# EAGLE board MMC_2 (EAGLE 9.6.2)
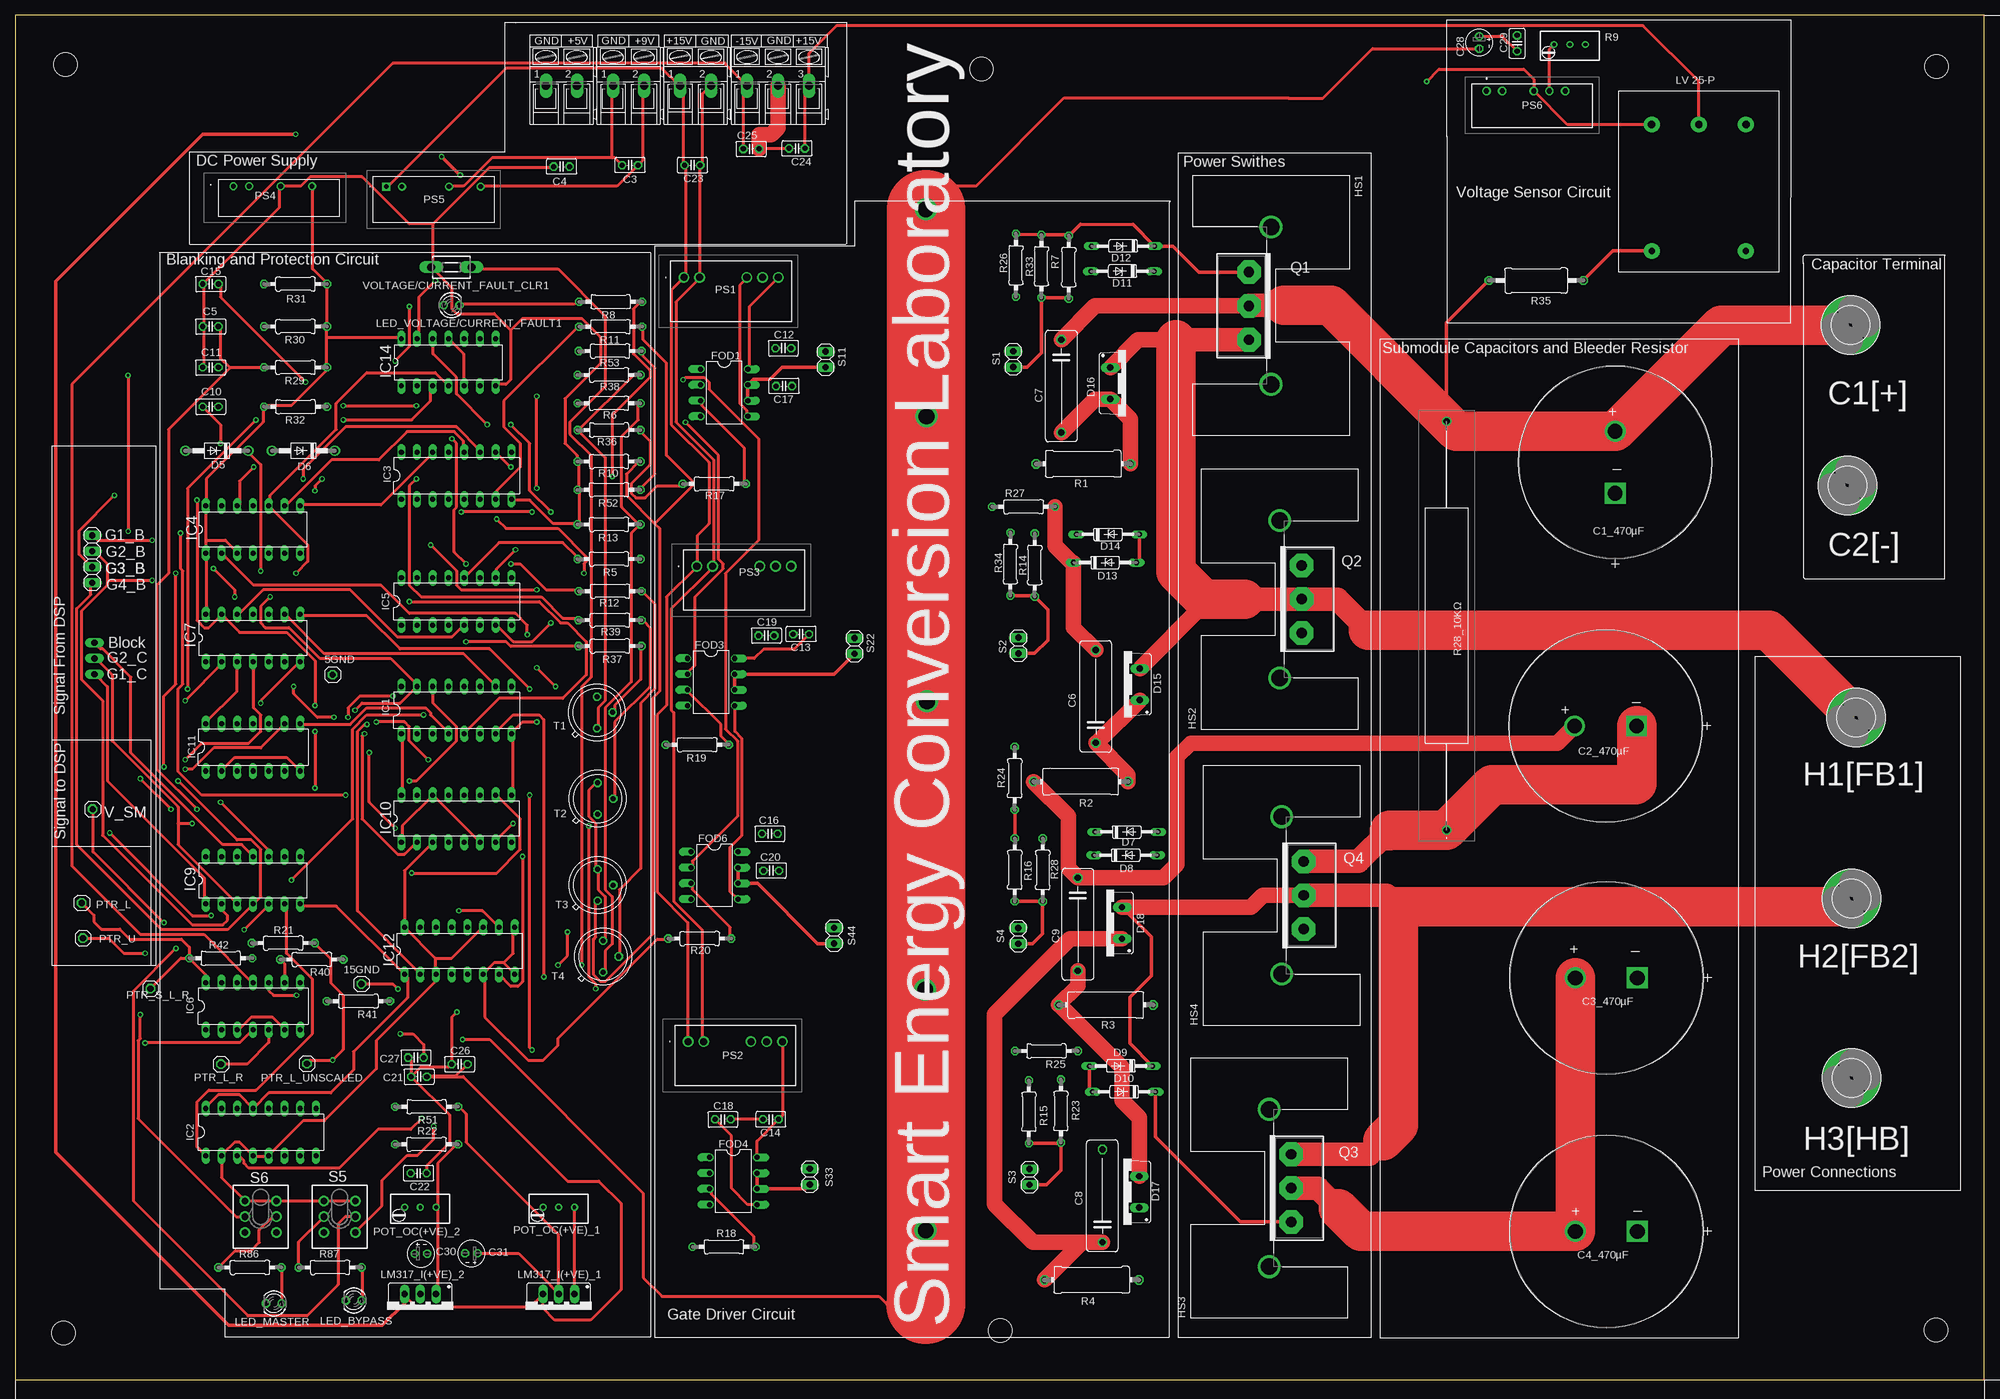
[diagram p2: board, top side]
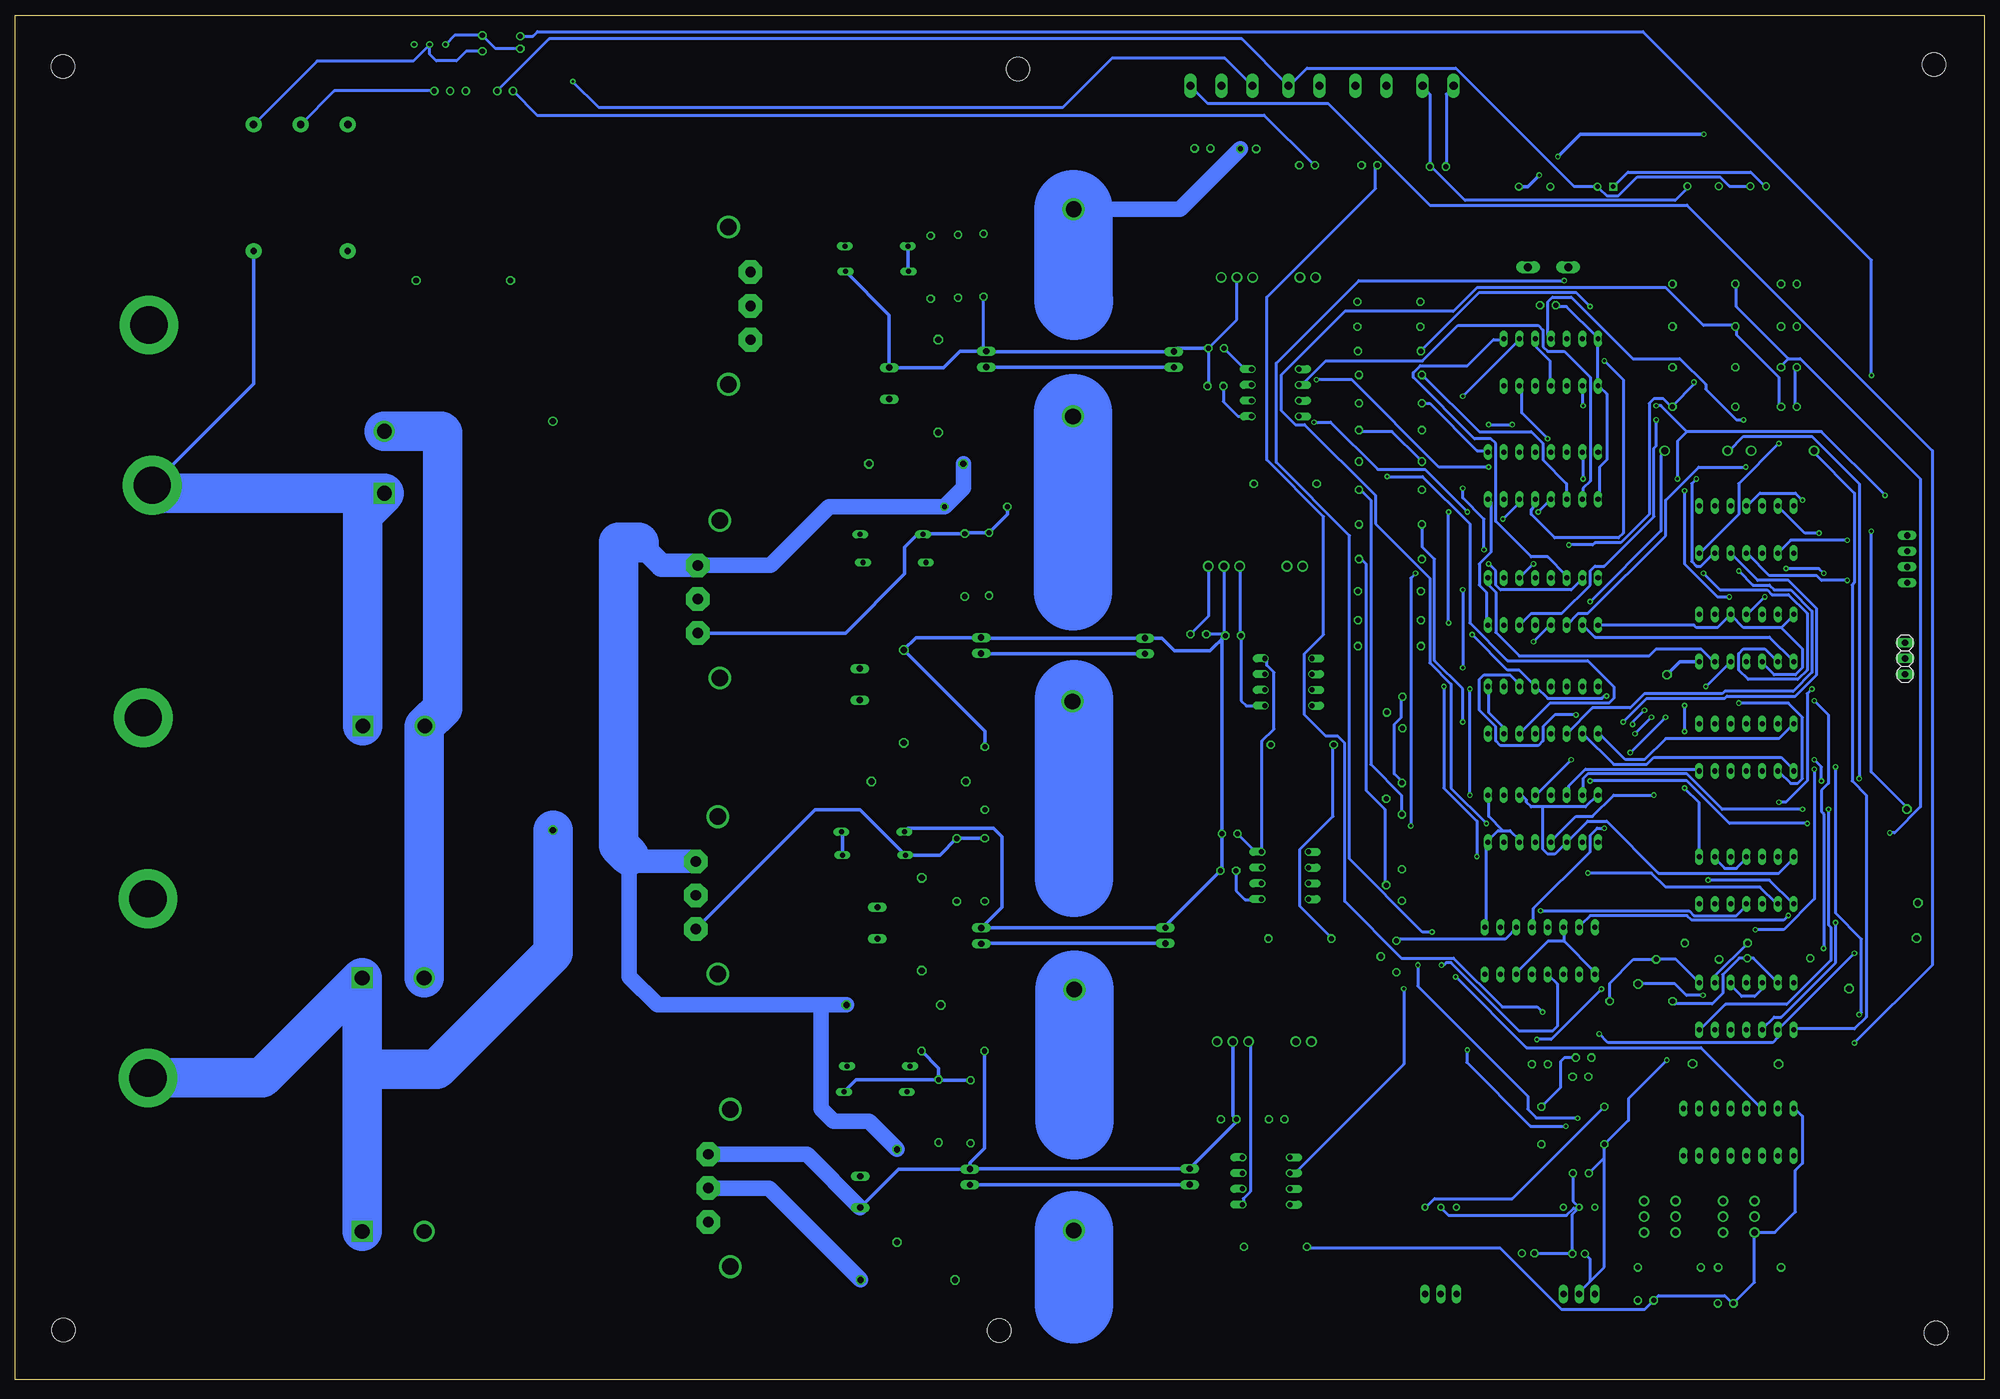
[diagram p3: board, bottom side, seen from below]

Size 317.85 x 220.25 mm. Coordinates in mm from the lower left corner, seen from the top.
Outline: 0,0 317.85,0 317.85,220.25 0,220.25 0,0
Copper layers (1*16): Top 0.035mm / dielectric 1.5mm / Bottom 0.035mm
Design rules "default": minimum track width 6mil, minimum drill 0.35mm, track to track 6mil, track to pad 6mil, pad to pad 6mil, via to via 6mil, smd to smd 6mil, copper to edge 40mil, drill to drill 6mil, minimum pad ring 10mil, minimum via ring 8mil, stop-mask expansion 4mil, vias tented up to drill 0mil, thermal gap 10mil
Net classes: 0 default: width 0.457 mm, drill 0.457 mm, clearance 0.305 mm
Holes 3.81 mm at 310.11,8.05 310.15,212.03 155.98,211.6 159.02,7.98 7.77,7.54 8.08,212.36

## Footprints (pad centres in the part's own frame; a part is rotated, then mirrored left to right if it is on the bottom)
1X01 = drill 1.016 octagon: 1 0,0
6-PAD = drill 6 pad 9.5: B5,5 0,0
CAP_2157_30X50_VIS = drill 2.362 pad 2.87 square: 1 0,0 | drill 2.362 pad 2.87: 2 10.008,0
C025-025X050 = drill 0.813 octagon: 1 -1.27,0; 2 1.27,0
C150-054X183 = drill 1.016 octagon: 1 -7.493,0; 2 7.493,0
E2-4 = drill 0.813 pad 1.27: + -1.016,0 | drill 0.813 pad 1.27 octagon: - 1.016,0
DO41-10 = drill 1.118: A 5.08,0; C -5.08,0
DO35Z10 = drill 0.813 long: A 5.08,0; C -5.08,0
TO220ACS = drill 1.016 long: A 2.54,-2.54; C -2.54,-2.54
DIL08 = drill 0.813 offset: 1 -3.81,-3.81; 2 -1.27,-3.81; 3 1.27,-3.81; 4 3.81,-3.81; 5 3.81,3.81; 6 1.27,3.81; 7 -1.27,3.81; 8 -3.81,3.81
1X03 = drill 1.016 long: 1 -2.54,0; 2 0,0; 3 2.54,0
1X04 = drill 1.016 long: 1 -3.81,0; 2 -1.27,0; 3 1.27,0; 4 3.81,0
HSINK_6396BG = drill 2.67: 1 -12.7,0; 2 12.7,0
DIL16 = drill 0.813 long: 1 -8.89,-3.81; 2 -6.35,-3.81; 3 -3.81,-3.81; 4 -1.27,-3.81; 5 1.27,-3.81; 6 3.81,-3.81; 7 6.35,-3.81; 8 8.89,-3.81; 9 8.89,3.81; 10 6.35,3.81; 11 3.81,3.81; 12 1.27,3.81; 13 -1.27,3.81; 14 -3.81,3.81; 15 -6.35,3.81; 16 -8.89,3.81
DIL14 = drill 0.8 long: 1 -7.62,-3.81; 2 -5.08,-3.81; 3 -2.54,-3.81; 4 0,-3.81; 5 2.54,-3.81; 6 5.08,-3.81; 7 7.62,-3.81; 8 7.62,3.81; 9 5.08,3.81; 10 2.54,3.81; 11 0,3.81; 12 -2.54,3.81; 13 -5.08,3.81; 14 -7.62,3.81
DIL14' = drill 0.813 long: 1 -7.62,-3.81; 2 -5.08,-3.81; 3 -2.54,-3.81; 4 0,-3.81; 5 2.54,-3.81; 6 5.08,-3.81; 7 7.62,-3.81; 8 7.62,3.81; 9 5.08,3.81; 10 2.54,3.81; 11 0,3.81; 12 -2.54,3.81; 13 -5.08,3.81; 14 -7.62,3.81
LV25-P = drill 1 pad 2.54: 1 -7.54,9.15; 2 7.66,9.15 | drill 1.2 pad 2.54: 3 -7.54,-11.25; 4 0.06,-11.25; 5 7.66,-11.25
LED3MM = drill 0.813 octagon: A -1.27,0; K 1.27,0
317TS = drill 1.016 long: 1 -2.54,-2.54; 2 0,-2.54; 3 2.54,-2.54
RTRIMT93YA = drill 0.61: 1 0,-2.54; 2 0,0; 3 0,2.54
MGJ2D151505SC = drill 1.15 pad 1.725: 1 0,0; 2 2.54,0; 5 10.16,0; 6 12.7,0; 7 15.24,0
TMA0505S = drill 0.76 pad 1.26: 1 0,0; 2 2.54,0; 4 7.62,0; 6 12.7,0
TMV1512SHI = drill 0.76 pad 1.303 square: 1 0,0 | drill 0.76 pad 1.303: 2 2.54,0; 5 10.16,0; 7 15.24,0
TMA0515D = drill 0.83 pad 1.33: 1 0,0; 2 2.54,0; 3 7.62,0; 4 10.16,0; 5 12.7,0
TO247-V = drill 1.676 pad 3.81 octagon: 1 -5.461,0; 2 0,0; 3 5.461,0
0414/15 = drill 1.016 octagon: 1 -7.62,0; 2 7.62,0
0207/10 = drill 0.813 octagon: 1 -5.08,0; 2 5.08,0
SBCHE610KJ = drill 1 pad 1.5: 1 0,0; 2 66,0
0411/15 = drill 0.914 octagon: 1 -7.62,0; 2 7.62,0
1X02 = drill 1.016 long: 1 -1.27,0; 2 1.27,0
TL4XPO = drill 1.1 pad 1.676: 1 -2.54,2.54; 2 0,2.54; 3 2.54,2.54; 4 -2.54,-2.54; 5 0,-2.54; 6 2.54,-2.54
TO39 = drill 0.813 octagon: 1 0,-2.54; 2 2.54,0; 3 0,2.54
DTS-3 = drill 1.3 long: 1 -3.25,0; 2 3.25,0
AK300/2 = drill 1.321 long: 1 -2.515,0; 2 2.489,0
AK300/3 = drill 1.321 long: 1 -5.004,0; 2 0,0; 3 5.004,0

## Placement (x,y rotation side)
5GND  [1X01]  51.2,113.82 0 top
15GND  [1X01]  55.86,63.93 0 top
C1  [6-PAD]  296.3,170.28 0 top
C1_470µF  MAL215746471E3  [CAP_2157_30X50_VIS]  258.3,143.12 90 top
C2  [6-PAD]  295.79,144.39 180 top
C2_470µF  MAL215746471E3  [CAP_2157_30X50_VIS]  261.75,105.56 180 top
C3  0.1uF  [C025-025X050]  99.23,196.09 180 top
C3_470µF  MAL215746471E3  [CAP_2157_30X50_VIS]  261.88,64.89 180 top
C4  0.1uF  [C025-025X050]  88.18,195.87 180 top
C4_470µF  MAL215746471E3  [CAP_2157_30X50_VIS]  261.88,23.97 180 top
C5  470pF  [C025-025X050]  31.5,170.05 0 top
C6  10nF  [C150-054X183]  174.43,110.33 90 top
C7  10nF  [C150-054X183]  168.87,160.42 270 top
C8  10nF  [C150-054X183]  175.51,29.71 90 top
C9  10nF  [C150-054X183]  171.53,73.55 270 top
C10  470pF  [C025-025X050]  31.5,157.09 0 top
C11  470pF  [C025-025X050]  31.5,163.44 0 top
C12  0.1uF  [C025-025X050]  123.98,166.54 0 top
C13  0.1uF  [C025-025X050]  126.85,120.39 180 top
C14  0.1uF  [C025-025X050]  121.95,42.06 180 top
C15  470pF  [C025-025X050]  31.5,176.9 0 top
C16  0.1uF  [C025-025X050]  121.8,88.16 0 top
C17  0.1uF  [C025-025X050]  124.1,160.43 180 top
C18  0.1uF  [C025-025X050]  114.21,42.06 0 top
C19  0.1uF  [C025-025X050]  121.24,120.16 0 top
C20  0.1uF  [C025-025X050]  122.03,82.21 0 top
C21  0.1uF  [C025-025X050]  65.16,48.95 0 top
C22  1uF  [C025-025X050]  65.09,33.36 180 top
C23  0.1uF  [C025-025X050]  109.3,196.08 180 top
C24  0.1uF  [C025-025X050]  126.18,198.79 180 top
C25  0.1uF  [C025-025X050]  118.79,198.71 0 top
C26  0.1uF  [C025-025X050]  71.71,50.97 0 top
C27  1uF  [C025-025X050]  64.65,52.04 0 top
C28  [E2-4]  236.34,215.91 270 top
C29  1uF  [C025-025X050]  242.46,215.75 90 top
C30  [E2-4]  65.48,20.38 0 top
C31  [E2-4]  73.6,20.43 180 top
D5  1N4004  [DO41-10]  32.52,149.98 180 top
D6  1N4004  [DO41-10]  46.49,149.98 180 top
D7  [DO35Z10]  179.41,88.46 0 top
D8  [DO35Z10]  179.25,84.7 0 top
D9  [DO35Z10]  178.49,50.67 180 top
D10  [DO35Z10]  179,46.5 180 top
D11  [DO35Z10]  178.75,178.96 180 top
D12  [DO35Z10]  178.85,183.03 180 top
D13  [DO35Z10]  175.93,131.95 0 top
D14  [DO35Z10]  176.38,136.49 0 top
D15  BYW80  [TO220ACS]  179,112.29 90 top
D16  BYW80  [TO220ACS]  179.31,160.88 270 top
D17  BYW80  [TO220ACS]  178.92,30.35 90 top
D18  BYW80  [TO220ACS]  176.13,73.76 90 top
FOD1  FOD3182  [DIL08]  114.43,159.35 270 top
FOD3  FOD3182  [DIL08]  112.3,112.64 270 top
FOD4  FOD3182  [DIL08]  115.91,32.1 270 top
FOD6  FOD3182  [DIL08]  112.86,81.43 270 top
GATE_SIGNAL_FROM_DSP  [1X03]  12.76,116.45 90 bottom
GATE_SIGNALS_BLANKING  [1X04]  12.4,132.51 270 top
H1  [6-PAD]  297.21,106.9 0 top
H2  [6-PAD]  296.45,77.69 0 top
H3  [6-PAD]  296.45,48.74 0 top
HS1  6396BG  [HSINK_6396BG]  202.74,173.41 270 top
HS2  6396BG  [HSINK_6396BG]  204.13,126.02 90 top
HS3  6396BG  [HSINK_6396BG]  202.43,30.97 90 top
HS4  6396BG  [HSINK_6396BG]  204.44,78.21 90 top
IC1  4050N  [DIL16]  71.2,108.12 0 top
IC2  7476N  [DIL16]  39.63,40 0 top
IC3  4050N  [DIL16]  71.2,145.97 0 top
IC4  74AC11N  [DIL14]  38.36,137.28 0 top
IC5  4050N  [DIL16]  71.2,125.65 0 top
IC6  TL064P  [DIL14']  38.36,60.32 0 top
IC7  74AC11N  [DIL14]  38.36,119.75 0 top
IC8  LV25-P  [LV25-P]  271.86,191.38 180 top
IC9  74ALS04N  [DIL14]  38.36,80.64 0 top
IC10  74LS123N  [DIL16]  71.2,90.6 0 top
IC11  4075N  [DIL14']  38.36,102.1 0 top
IC12  74LS123N  [DIL16]  71.71,69.26 0 top
IC14  74AC11N  [DIL14]  69.93,164.26 0 top
LED_BYPASS  [LED3MM]  54.62,12.82 180 top
LED_MASTER  [LED3MM]  41.71,12.34 180 top
LED_VOLTAGE/CURRENT_FAULT1  [LED3MM]  70.42,173.48 0 top
LM317_I(+VE)_1  [317TS]  87.71,11.35 180 top
LM317_I(+VE)_2  [317TS]  65.36,11.35 180 top
POT_OC(+VE)_1  [RTRIMT93YA]  87.71,27.86 90 top
POT_OC(+VE)_2  [RTRIMT93YA]  65.36,27.86 90 top
PS1  MGJ2D151505SC  [MGJ2D151505SC]  107.93,177.97 0 top
PS2  MGJ2D151505SC  [MGJ2D151505SC]  108.59,54.6 0 top
PS3  MGJ2D151505SC  [MGJ2D151505SC]  110.01,131.34 0 top
PS4  TMA_1505S  [TMA0505S]  35.19,192.68 0 top
PS5  TMV_1509SHI  [TMV1512SHI]  59.87,192.63 0 top
PS6  TMA_0515D  [TMA0515D]  237.52,208.07 0 top
PTR_L  [1X01]  10.69,76.99 0 top
PTR_L_R  [1X01]  33.18,50.96 0 top
PTR_L_UNSCALED  [1X01]  47.06,51.04 0 top
PTR_S_L_R  [1X01]  21.77,63.15 0 top
PTR_U  [1X01]  10.89,71.3 0 top
Q1  TIP35-V  [TO247-V]  199.17,173.37 270 top
Q2  TIP35-V  [TO247-V]  207.7,126.03 90 top
Q3  TIP35-V  [TO247-V]  206,30.96 90 top
Q4  TIP35-V  [TO247-V]  208.01,78.23 90 top
R1  2kΩ  [0414/15]  172.42,147.87 180 top
R2  2kΩ  [0414/15]  172.02,96.59 0 top
R3  2kΩ  [0414/15]  176.05,60.52 0 top
R4  2kΩ  [0414/15]  173.77,16.15 180 top
R5  220Ω  [0207/10]  95.84,132.51 0 top
R6  47Ω  [0207/10]  95.84,157.65 0 top
R7  18Ω  [0207/10]  170.07,179.62 270 top
R8  680Ω  [0207/10]  96.1,174.03 180 top
R9  300 R  [RTRIMT93YA]  250.96,215.56 90 top
R10  1.2kΩ  [0207/10]  95.84,148.25 0 top
R11  47Ω  [0207/10]  96.1,170.02 0 top
R12  220Ω  [0207/10]  96.02,127.32 0 top
R13  1.2kΩ  [0207/10]  95.84,138.09 0 top
R14  18Ω  [0207/10]  164.57,131.54 270 top
R15  18Ω  [0207/10]  163.62,43.28 90 top
R16  18Ω  [0207/10]  161.35,82.34 90 top
R17  220Ω  [0207/10]  112.83,144.65 0 top
R18  220Ω  [0207/10]  114.41,21.48 0 top
R19  220Ω  [0207/10]  110.09,102.53 0 top
R20  220Ω  [0207/10]  110.47,71.24 0 top
R21  10kΩ  [0207/10]  43.25,70.52 0 top
R22  120Ω  [0207/10]  66.38,38.02 0 top
R23  18Ω  [0207/10]  168.79,43.4 90 top
R24  1kΩ  [0207/10]  161.34,97.11 90 top
R25  1kΩ  [0207/10]  166.47,53.09 180 top
R26  1kΩ  [0207/10]  161.54,179.94 270 top
R27  1kΩ  [0207/10]  162.78,140.95 0 top
R28  18Ω  [0207/10]  165.87,82.32 90 top
R28_10KΩ  SBCHE610KJ  [SBCHE610KJ]  231.07,88.74 90 top
R29  12kΩ  [0207/10]  45.22,163.44 0 top
R30  12kΩ  [0207/10]  45.22,170.05 0 top
R31  12kΩ  [0207/10]  45.22,176.9 0 top
R32  12kΩ  [0207/10]  45.22,157.09 180 top
R33  18Ω  [0207/10]  165.65,179.78 270 top
R34  18Ω  [0207/10]  160.64,131.69 270 top
R35  75kΩ  [0411/15]  245.54,177.48 0 top
R36  1.2kΩ  [0207/10]  95.84,153.33 180 top
R37  220Ω  [0207/10]  95.99,118.46 0 top
R38  47Ω  [0207/10]  95.84,162.22 0 top
R39  220Ω  [0207/10]  95.99,122.65 0 top
R40  2kΩ  [0207/10]  47.86,67.88 0 top
R41  10kΩ  [0207/10]  55.37,61.14 180 top
R42  10kΩ  [0207/10]  33.14,68.07 180 top
R51  120Ω  [0207/10]  66.38,44.11 180 top
R52  1.2kΩ  [0207/10]  95.84,143.68 0 top
R53  47Ω  [0207/10]  96.02,166.08 0 top
R86  680Ω  [0207/10]  37.85,18.15 0 top
R87  680Ω  [0207/10]  50.81,18.15 0 top
S1  [1X02]  161.11,164.76 90 top
S2  [1X02]  161.94,118.55 90 top
S3  [1X02]  163.74,32.77 90 top
S4  [1X02]  161.91,71.69 90 top
S5  TL42PO  [TL4XPO]  52.34,26.35 270 top
S6  TL42PO  [TL4XPO]  39.59,26.35 270 top
S11  [1X02]  130.8,164.73 90 top
S22  [1X02]  135.48,118.48 90 top
S33  [1X02]  128.26,32.8 90 top
S44  [1X02]  132.18,71.72 90 top
T1  2N1711  [TO39]  93.89,107.74 0 top
T2  2N1711  [TO39]  93.99,93.82 0 top
T3  2N1711  [TO39]  93.99,79.88 0 top
T4  2N1711  [TO39]  94.88,68.35 0 top
V_SM  [1X01]  12.47,92.13 0 top
VOLTAGE/CURRENT_FAULT_CLR1  DTS-3  [DTS-3]  70.39,179.62 180 top
X1  [AK300/2]  88.16,208.9 0 top
X2  [AK300/2]  99,208.9 0 top
X3  [AK300/2]  109.81,208.91 0 top
X4  [AK300/3]  123.13,208.9 0 top

## Tracks (layer width: path | path; a pad name or v marks a point on that pad's centre or on a via)
5GND  (via drill 0.46)
  Top 0.457: v33.12,151.16 33.12,154.21 C10.1 | C11.1 30.45,163.74 30.45,169.83 C5.1 30.45,170.21 30.45,176.69 C15.1 30.45,177.07 42.64,189.26 42.64,192.31 PS4.4 43.02,192.69 46.07,192.69 47.59,194.22 55.98,194.22 63.6,186.59 67.41,186.59 | R17.1 107.41,144.3 103.6,144.3 101.7,142.4 100.17,142.4 99.41,143.16 99.41,144.69 102.46,147.73 102.46,151.54 100.93,153.07 R36.1 | IC3.8 80.36,142.02 83.03,142.02 86.84,138.21 90.65,138.21 R13.1 91.03,138.21 91.03,143.54 R52.1 91.03,143.92 91.03,148.11 R10.1 90.65,148.5 90.65,149.26 88.74,151.16 88.74,158.4 94.46,164.12 94.46,168.31 91.41,171.35 81.88,171.35 79.98,169.45 | 79.98,169.45 79.98,161.45 79.22,160.69 77.69,160.69 IC14.7 | 79.98,169.45 77.31,172.12 71.22,172.12 70.45,172.88 70.45,176.31 67.41,179.36 VOLTAGE/CURRENT_FAULT_CLR1.2 67.41,179.74 67.41,186.59 | 67.41,186.59 76.55,195.74 86.84,195.74 C4.2 | IC2.16 30.83,44.1 32.73,46.01 36.16,46.01 IC2.13 40.9,46.35 50.91,46.35 54.59,50.03 54.59,52.98 63.32,61.7 63.32,64.95 IC12.1 51.78,76.49 46.07,76.49 IC9.7 | v39.59,109.25 39.59,109.63 45.69,115.73 IC7.7 | IC11.7 43.78,100.49 35.4,100.49 33.5,98.58 IC11.2 | 67.41,94.39 62.45,89.44 62.45,87.15 IC10.1 | IC10.9 80.36,94.77 80.36,104.3 IC1.8 80.36,104.68 81.88,106.2 v84.17,106.2 | IC10.6 67.41,94.39 | 67.41,94.39 IC10.14 | 78.84,67.34 77.31,67.34 75.79,65.82 IC12.6 75.79,65.44 75.79,58.58 82.77,51.59 85.19,51.59 87.6,54.01 87.6,55.15 103.6,71.15 105.12,71.15 R20.1 | 78.84,67.34 80.36,65.82 IC12.8 | 78.84,67.34 80.36,68.87 80.36,73.06 IC12.9
  Bottom 0.457: v33.12,151.16 39.59,144.69 39.59,139.73 45.69,133.64 IC4.7 | C11.1 30.45,163.35 30.45,157.26 C10.1 | IC5.8 80.36,122.21 80.36,127.16 81.5,128.3 81.5,131.73 79.6,133.64 79.6,141.64 79.98,142.02 IC3.8 | R36.1 100.55,153.07 95.6,153.07 91.03,148.5 R10.1 | C4.2 86.84,196.12 86.84,207.55 85.69,208.69 X1.1 | IC2.16 30.45,43.72 29.31,42.58 29.31,34.96 30.45,33.81 30.45,27.11 33.75,23.81 S6.6 37.05,15.73 LED_MASTER.K 40.74,12.48 41.88,13.62 52.55,13.62 LED_BYPASS.K 54.83,11.34 68.17,11.34 78.07,21.24 109.32,21.24 R18.1 | v39.59,109.25 31.59,109.25 29.31,106.97 29.31,97.06 30.07,96.3 31.21,96.3 33.12,98.2 IC11.2 | 77.69,88.68 78.45,88.68 79.98,87.15 IC10.8 80.36,86.77 80.36,73.44 IC12.9 | 77.69,88.68 76.55,88.68 75.03,87.15 IC10.6 | 77.69,88.68 79.98,90.96 79.98,94.39 IC10.9 | IC11.7 46.07,98.58 64.36,98.58 67.03,95.92 67.03,94.77 IC10.14 | R19.1 105.12,102.39 105.12,90.96 110.46,85.63 110.46,76.49 105.51,71.53 R20.1 | 67.79,70.77 67.79,73.06 IC12.14 | 67.79,70.77 62.83,65.82 IC12.1 | 67.79,70.77 70.45,70.77 75.41,65.82 IC12.6 | v84.17,106.2 84.17,111.54 88.74,116.11 88.74,132.49 90.65,134.4 90.65,137.83 R13.1
  Bottom 0.559: IC7.7 49.08,115.94 5GND.1
9GND  (via drill 0.46)
  Top 0.457: 96.36,197.26 96.74,197.26 97.89,196.12 C3.2 | 96.36,197.26 76.93,197.26 72.36,192.69 70.07,192.69 PS5.5 | 96.36,197.26 96.36,208.69 X2.1 | C27.1 63.89,51.53 C21.1 | C21.1 70.07,42.77 70.07,38.26 66.36,34.55 C22.1 | C21.1 65.49,50.55 70.02,50.55 C26.1 | C26.1 70.58,51.11 | v71.27,59.37 70.44,58.54 C26.1
  Bottom 0.457: POT_OC(+VE)_2.2 65.5,27.72 66.26,27.72 67.41,26.57 86.46,26.57 87.6,27.72 POT_OC(+VE)_1.2 | 65.12,28.1 POT_OC(+VE)_2.2 | C3.2 98.27,195.74 98.27,192.31 115.79,174.78 115.79,148.5 106.65,139.35 106.65,120.3 109.7,117.25 109.7,107.35 106.27,103.92 104.36,103.92 103.22,102.78 103.22,77.25 94.08,68.1 85.64,68.1 77.77,60.23 72.13,60.23 v71.27,59.37 | C22.1 66.36,28.86 POT_OC(+VE)_2.2 | POT_OC(+VE)_2.2 66.49,26.73 C30.- 72.54,20.38 C31.-
15GND  (via drill 0.46, 2.54)
  Top 0.457: C25.2 120.14,198.79 C24.2 | IC6.10 40.9,62.85 41.66,62.08 v45.39,62.08 | 15GND.1 60.93,63.93 v61.77,63.09 | v72.19,54.96 76.53,54.96 101.37,30.12 101.37,16.53 104.39,13.5 139.41,13.5 141.64,11.27 | PS6.4 247.68,214.83 R9.3 | v146.98,188.96 150.77,192.74 155.14,192.74 169.34,206.94 205.53,206.94 205.56,206.91 211.15,206.91 219.12,214.89 C28.- | 141.64,11.27 142.13,10.79 | 146.98,12.24 142.61,12.24 141.64,11.27
  Top 12.7: 146.91,12.17 146.98,12.24 v146.98,188.96
  Top 2.54: X4.2 123.13,202.14 122.03,201.03 120.02,201.03 120.02,198.75 C25.2
  Bottom 0.457: IC6.12 35.82,63.13 37.03,61.92 39.12,61.92 40.9,63.7 IC6.10 | v45.39,62.08 48.06,62.08 49.91,63.93 15GND.1 | v61.77,63.09 69.89,54.96 v72.19,54.96 | R9.3 246.96,217.02 C29.2 240.33,214.89 C28.-
  Bottom 12.7: v146.98,188.96 146.98,174.31 146.91,174.24
  Bottom 2.54: C25.2 129.81,188.96 v146.98,188.96
+5V
  Top 0.457: T4.3 95.22,71.15 95.22,78.01 94.08,79.15 94.08,82.2 T3.3 93.69,82.58 93.69,89.82 92.55,90.96 92.55,95.16 93.69,96.3 T2.3 | IC10.16 62.45,94.77 62.45,104.3 IC1.1 | 67.79,68.1 67.79,65.82 IC12.3 67.79,65.44 67.79,64.29 58.26,54.77 58.26,50.2 49.88,41.81 46.45,41.81 41.12,36.48 IC2.5 40.74,36.1 38.45,36.1 IC2.4 36.16,38.39 35.4,38.39 33.5,36.48 IC2.2 33.28,32.66 S6.4 S6.1 S5.4 S5.1 | 67.79,68.1 IC12.16 62.83,73.44 62.83,82.2 67.41,86.77 IC10.3 | 67.79,68.1 70.45,68.1 75.41,73.06 IC12.11 | IC7.3 35.78,115.73 35.78,111.16 30.83,106.2 IC11.14 | IC7.14 30.83,123.73 30.83,133.25 IC4.1 30.83,133.64 30.83,135.54 | 30.83,135.54 30.83,140.88 IC4.14 30.83,141.26 30.83,145.45 39.97,154.59 39.97,156.88 R32.2 40.35,157.26 44.55,157.26 50.64,163.35 R29.2 50.26,163.74 50.26,168.31 | 30.83,135.54 33.88,135.54 35.78,133.64 IC4.3 | 50.26,168.31 50.26,169.83 R30.2 50.26,170.21 50.26,176.69 R31.2 50.26,177.07 47.98,179.36 47.98,192.31 PS4.6 | 50.26,168.31 62.07,168.31 IC14.14
  Bottom 0.457: T1.3 94.08,110.01 94.08,106.97 95.22,105.82 95.22,97.82 94.08,96.68 T2.3 | 40.74,36.1 IC2.5 | 71.22,92.49 64.36,92.49 62.45,94.39 IC10.16 | 71.22,92.49 73.12,92.49 73.88,93.25 73.88,93.63 74.64,94.39 IC10.11 | IC9.14 30.83,84.11 33.12,81.82 52.55,81.82 60.93,90.2 63.98,90.2 IC10.3 69.31,84.87 70.45,84.87 71.22,85.63 71.22,92.49 | T4.3 94.84,71.15 77.31,71.15 75.41,73.06 IC12.11 | 32.73,121.44 38.83,121.44 40.74,123.35 IC7.10 43.02,121.44 46.45,121.44 46.83,121.83 62.07,121.83 IC5.1 | 32.73,121.44 30.83,123.35 IC7.14 | 32.73,121.44 29.31,118.02 29.31,114.97 30.45,113.82 33.88,113.82 35.78,115.73 IC7.3 | IC3.1 62.07,142.4 62.07,147.35 60.93,148.5 60.93,159.16 62.07,160.31 IC14.1 62.45,160.69 62.45,167.93 IC14.14 62.45,168.31 67.41,173.26 68.93,173.26 LED_VOLTAGE/CURRENT_FAULT1.A | X1.2 90.65,208.69 89.5,207.55 89.5,196.12 C4.1 89.12,195.74 83.79,190.41 49.88,190.41 47.98,192.31 PS4.6 | IC11.14 33.12,103.54 51.4,103.54 54.83,100.11 57.88,100.11 62.07,104.3 IC1.1
+9V  (via drill 0.46)
  Top 0.457: LM317_I(+VE)_2.3 62.83,13.62 64.74,11.72 83.03,11.72 84.93,13.62 LM317_I(+VE)_1.3 85.17,11.53 87.07,9.63 92.83,9.63 97.76,14.56 97.76,28.5 94.18,32.09 89.15,32.09 72.28,48.95 C21.2 66.56,49.08 71.09,49.08 C26.2 | PS5.7 75.41,192.69 97.12,192.69 100.17,195.74 C3.1 100.55,196.12 101.31,196.88 101.31,208.69 X2.2
  Top 0.559: LM317_I(+VE)_2.3 62.82,12.39 59.24,8.81 34.44,8.81 6.51,36.73 6.51,177.35 30.25,201.09 v45.24,201.09 | v68.8,197.47 71.79,194.48 v71.81,194.48
  Bottom 0.559: v45.24,201.09 65.18,201.09 v68.8,197.47 | v71.81,194.48 73.67,192.63 PS5.7
+15_S1
  Top 0.457: PS1.7 118.46,173.26 118.46,163.35 FOD1.8
  Bottom 0.457: C12.1 119.34,163.16 FOD1.8
+15_S2_S4
  Top 0.457: C13.1 125.67,117.94 120.77,117.94 119.28,116.45 FOD3.8
  Bottom 0.457: FOD3.8 115.79,116.11 115.79,115.35 114.65,114.2 114.65,105.06 116.56,103.16 116.56,85.25 FOD6.8 117.61,85.24 C16.1 | PS3.7 125.25,123.26 C13.1
+15_S3
  Top 0.457: PS2.7 123.83,42.67 C14.1 119.72,38.55 FOD4.8
+15V  (via drill 0.46)
  Top 0.457: v20.92,54.39 21.09,54.39 21.13,54.43 36.2,54.43 38.07,56.29 IC6.4 | IC8.4 271.8,209.6 262.78,218.62 132.61,218.62 128.14,214.15 X4.3 127.45,208.21 C24.1
  Bottom 0.457: v20.92,54.39 8.35,66.96 8.35,150.02 47.98,189.64 89.5,189.64 105.89,206.03 125.32,206.03 128.14,208.84 X4.3 | PS6.5 266.37,208.07 IC8.4
-5_S1
  Top 0.457: FOD1.5 118.08,155.73 118.08,156.5 116.94,157.64 116.94,176.69 118.08,177.83 PS1.5
  Bottom 0.457: C17.2 122.83,157.92 120.45,155.54 FOD1.5
-5_S2_S4
  Top 0.457: FOD3.5 116.17,108.49 116.17,104.68 117.32,103.54 117.32,87.92 115.41,86.01 115.41,78.77 116.56,77.63 FOD6.5
  Bottom 0.457: C20.1 120.76,78.99 119.3,77.53 116.76,77.53 FOD6.5 | FOD3.5 116.15,108.8 119.12,108.8 119.97,109.65 C19.1 120.17,120.36 PS3.5
-5_S3
  Top 0.457: FOD4.5 118.24,28.29 115.59,30.94 115.59,39.4 C18.1
  Bottom 0.457: FOD4.5 119.6,28.48 119.6,29.24 118.46,30.39 118.46,54.39 PS2.5
-15V  (via drill 0.46)
  Top 0.457: IC6.11 38.07,64.29 30.45,71.91 20.16,71.91 9.11,82.96 9.11,160.69 60.93,212.5 114.65,212.5 114.65,212.38 X4.1 117.52,208.29 C25.1 117.52,198.58 | IC8.5 250.58,202.63 PS6.3 245.14,209.98 243.53,211.59 229.86,211.59 v227.86,209.58
  Bottom 0.457: X4.1 122.58,213.34 140.81,213.34 148.79,205.37 223.64,205.37 v227.86,209.58
AA
  Top 0.457: R33.1 161.7,184.85 R26.1 | 171.93,186.56 180.4,186.56
  Top 0.559: R33.1 169.92,184.85 R7.1 171.93,186.56 | 180.4,186.56 D12.C 186.89,183.03 191.08,178.84 Q1.1
BLOCK
  Top 0.457: GATE_SIGNAL_FROM_DSP.3 12.92,118.78 13.69,118.02 14.07,118.02 18.64,113.44 18.64,101.25 33.5,86.39 36.55,86.39 38.45,84.49 IC9.11
  Bottom 0.457: IC9.11 38.45,84.11 39.97,82.58 41.88,82.58 43.4,84.11 IC9.9
G1_B  (via drill 0.46)
  Top 0.457: v22.07,135.54 13.3,135.54 12.54,136.3 GATE_SIGNALS_BLANKING.1 | v56.36,104.3 55.98,103.92 55.98,90.58 61.69,84.87 62.83,84.87 64.74,86.77 IC10.2 | v53.69,106.97 53.69,108.49 55.59,110.39 v60.93,110.39 | IC4.2 38.45,128.3 59.02,128.3 63.6,123.73 80.74,123.73 82.65,121.83 v82.65,120.3
  Bottom 0.457: IC4.2 31.21,135.54 v22.07,135.54 | v53.69,106.97 v56.36,104.3 | v60.93,110.39 61.31,110.39 61.69,110.01 70.45,110.01 72.36,111.92 IC1.12 72.74,112.3 75.03,114.59 76.93,114.59 v82.65,120.3
G1_C  (via drill 0.46)
  Top 0.457: IC9.1 30.45,76.87 30.45,81.06 14.83,96.68 14.83,111.92 12.92,113.82 GATE_SIGNAL_FROM_DSP.1 | v65.88,107.35 56.74,107.35 54.45,105.06 54.45,90.58 v44.55,80.68
  Bottom 0.457: v65.88,107.35 69.31,107.35 71.22,105.44 71.22,103.16 71.98,102.39 78.07,102.39 78.84,103.16 78.84,105.44 81.5,108.11 81.5,113.06 80.74,113.82 76.55,113.82 75.03,112.3 IC1.11 | v44.55,80.68 34.64,80.68 30.83,76.87 IC9.1
G2_B  (via drill 0.46)
  Top 0.457: 14.83,129.06 14.83,131.73 12.54,134.02 GATE_SIGNALS_BLANKING.2 | 14.83,129.06 14.83,128.3 10.64,124.11 10.64,113.06 14.07,109.63 14.07,87.92 28.54,73.44 33.5,73.44 34.26,74.2 34.26,74.96 33.5,75.72 33.5,76.49 IC9.2 | 14.83,129.06 v22.07,129.06 | v63.98,81.82 77.69,81.82 81.5,85.63 81.5,90.58 77.69,94.39 IC10.10
  Bottom 0.457: v22.07,129.06 26.26,129.06 27.02,129.83 34.64,129.83 38.07,133.25 IC4.4 | v63.98,81.82 53.69,81.82 51.4,79.53 36.16,79.53 33.5,76.87 IC9.2
G2_C  (via drill 0.46)
  Top 0.457: IC9.3 26.26,86.39 26.26,89.82 | 26.26,89.82 26.26,92.49 15.59,103.16 15.59,113.82 12.92,116.49 GATE_SIGNAL_FROM_DSP.2 | v63.6,96.68 64.74,96.68 71.22,103.16 71.22,105.44 67.41,109.25 67.41,111.92 IC1.14 | 26.26,89.82 v28.54,89.82
  Bottom 0.457: v63.6,96.68 47.98,96.68 41.12,89.82 v28.54,89.82
G3_B  (via drill 0.46)
  Top 0.457: v54.83,108.11 55.98,109.25 62.07,109.25 64.74,111.92 IC1.15 64.74,112.3 60.55,116.49 49.12,116.49 44.16,121.44 40.35,121.44 39.59,122.21 39.59,124.87 v41.12,126.4 | v56.74,105.82 56.36,105.82 55.21,104.68 55.21,75.72 65.12,65.82 IC12.2 | v52.93,157.26 v64.74,157.26 | v15.97,142.78 10.26,137.06 10.26,133.25 12.16,131.35 GATE_SIGNALS_BLANKING.3 | v48.36,143.54 48.36,144.3 v49.5,145.45
  Bottom 0.457: v54.83,108.11 56.74,106.2 v56.74,105.82 | v64.74,157.26 64.74,160.31 IC14.2 | v52.93,157.26 52.17,157.26 47.98,153.07 | 47.98,153.07 26.26,153.07 v15.97,142.78 | v41.12,126.4 43.02,126.4 48.36,131.73 v48.36,143.54 | v49.5,145.45 49.5,151.54 47.98,153.07
G4_B  (via drill 0.46)
  Top 0.457: v71.6,75.72 75.41,75.72 IC12.10 | v27.4,100.11 30.07,102.78 37.69,102.78 39.59,104.68 39.59,107.35 38.45,108.49 38.45,115.73 IC7.4 | v26.26,96.68 35.78,87.15 38.07,87.15 39.59,85.63 39.59,78.01 38.45,76.87 IC9.4 38.07,76.49 34.26,72.68 23.59,72.68 9.88,86.39 9.88,124.49 12.16,126.78 12.16,128.68 GATE_SIGNALS_BLANKING.4
  Bottom 0.457: v71.6,75.72 47.59,75.72 46.83,74.96 39.97,74.96 38.45,76.49 IC9.4 | v27.4,100.11 26.26,98.97 v26.26,96.68
GND(5)
  Top 0.457: FOD3.3 108.55,111.16 113.89,105.82 113.89,103.92 115.03,102.78 R19.2
N$1
  Bottom 0.457: IC3.2 64.74,142.4 64.74,143.92 63.6,145.07 63.6,161.83 67.79,166.02 70.45,166.02 71.22,166.78 71.22,169.45 71.98,170.21 84.93,170.21 90.65,164.5 106.27,164.5 110.46,160.31 FOD1.2
N$2
  Top 0.559: R16.2 161.35,92.02 R24.1
  Bottom 0.559: Q4.1 188.73,92.04 181.52,92.04 D8.C 168.56,84.7 R28.2 161.37,87.39 R16.2
N$3
  Top 0.559: D10.C 184.08,39.21 197.8,25.5 Q3.1
  Bottom 0.559: R23.2 182.1,48.48 D10.C | R15.2 168.66,48.35 R23.2 | R23.2 168.79,50.34 R25.1
N$4  (via drill 0.46)
  Top 0.457: v35.4,126.4 35.4,127.54 v31.97,130.97 | v25.88,130.21 25.88,112.3 23.97,110.39 v23.97,98.97 | v20.16,58.96 20.16,55.15 19.78,54.77 19.78,42.2 35.63,26.35 S6.5
  Bottom 0.457: v35.4,126.4 38.07,123.73 IC7.11 | v31.97,130.97 26.64,130.97 v25.88,130.21 | v23.97,98.97 23.97,75.34 19.78,71.15 19.78,59.34 v20.16,58.96
N$5
  Bottom 0.457: IC6.1 30.45,56.67 20.92,56.67 19.02,58.58 19.02,94.39 21.3,96.68 21.3,128.3 20.92,128.68 20.92,143.16 27.4,149.64 D5.A
N$6
  Top 0.457: IC7.9 43.78,123.35 49.88,117.25 72.36,117.25 77.31,112.3 IC1.10
N$7
  Top 2.54: D17.A 181.47,42.32 178.62,45.17 178.62,50.45 168.55,60.52 R3.1 171.53,63.62 C9.2
N$9  (via drill 0.46)
  Top 0.457: v67.79,177.45 65.12,174.78 65.12,168.31 IC14.13 | v89.12,72.3 89.12,68.48 v87.6,66.96
  Bottom 0.457: v67.79,177.45 100.93,177.45 114.27,164.12 114.27,148.11 102.46,136.3 102.46,84.11 90.65,72.3 v89.12,72.3 | v87.6,66.96 87.22,66.96 86.84,67.34 86.08,67.34 75.03,56.29 69.69,56.29 68.93,57.05 68.93,63.91 70.45,65.44 IC12.4
N$10  (via drill 0.46)
  Top 0.457: v76.17,154.21 71.22,159.16 71.22,161.83 67.41,165.64 67.41,167.93 IC14.12 | v79.98,154.21 83.03,151.16 83.03,143.54 v86.46,140.11 | v86.46,122.21 83.41,119.16 80.36,119.16 77.69,121.83 IC5.7
  Bottom 0.457: v79.98,154.21 v76.17,154.21 | v86.46,122.21 v86.46,140.11
N$11  (via drill 0.46)
  Top 0.457: v52.93,154.97 63.98,154.97 67.03,158.02 67.03,160.31 IC14.3
  Bottom 0.457: v52.93,154.97 52.93,150.78 53.31,150.4 53.31,139.35 61.31,131.35 62.83,131.35 63.6,130.59 63.6,128.3 68.17,123.73 73.12,123.73 IC5.6
N$12  (via drill 0.46)
  Top 0.457: v70.45,151.92 71.22,151.16 71.22,140.88 70.83,140.49 70.83,133.64 v72.74,131.73
  Bottom 0.457: v70.45,151.92 74.64,156.12 74.64,160.31 IC14.6 | IC5.11 v72.74,131.73
N$13
  Top 0.457: IC5.12 72.74,129.83 78.07,135.16 88.36,135.16 90.65,132.87 R5.1
N$14
  Bottom 0.457: T3.2 96.74,79.92 96.74,92.11 99.79,95.16 99.79,131.73 100.55,132.49 R5.2
N$15
  Top 2.54: R4.2 172.22,22.22 C8.1 164.26,22.22 158.11,28.37 158.11,59.04 170.29,71.22 D18.C
N$16
  Top 0.457: 103.22,138.21 98.65,142.78 98.65,146.21 100.55,148.11 R10.2 | 103.22,138.21 103.98,137.45 103.98,111.16 102.84,110.01 102.84,71.91 95.22,64.29 94.46,64.29 93.31,65.44 93.31,71.15 93.69,71.53 93.69,77.25 T3.1 | 103.22,138.21 109.32,144.3 109.32,145.07 105.12,149.26 105.12,164.12 101.31,167.93 101.31,169.83 R11.2
N$17  (via drill 0.46)
  Top 0.457: v79.98,131.73 81.5,131.73 85.69,127.54 90.65,127.54 R12.1
  Bottom 0.457: v79.98,131.73 78.84,130.59 78.84,128.3 78.07,127.54 66.64,127.54 64.74,129.44 IC5.15
N$18
  Top 2.54: D15.C 174.63,102.84 C6.1 179.64,97.63 R2.2
N$19
  Bottom 12.7: 147.07,156.06 147.07,127.29 147.09,127.27
N$20  (via drill 0.46)
  Top 0.457: v83.41,140.11 v71.98,140.11 | v108.17,154.59 113.51,149.26 113.51,132.49 114.27,131.73 114.27,130.97 109.7,126.4 109.7,115.35 108.55,114.2 FOD3.2
  Bottom 0.457: v71.98,140.11 IC3.4 | v83.41,140.11 90.27,146.97 97.89,146.97 105.51,154.59 v108.17,154.59
N$21
  Bottom 12.7: 146.97,109.87 146.97,81.07
N$22  (via drill 0.46)
  Top 0.457: v93.69,63.15 93.69,63.91 92.55,65.06 v92.55,89.44 | v91.79,130.21 91.79,131.73 92.17,132.11 92.17,132.87 87.6,137.45 79.22,137.45 v77.69,138.97
  Bottom 0.457: v93.69,63.15 93.69,50.96 111.22,33.43 111.98,33.43 FOD4.2 | v92.55,89.44 92.55,129.44 v91.79,130.21 | v77.69,138.97 74.64,142.02 IC3.6
N$23  (via drill 2.54)
  other vias: 147.09,155.53
N$24  (via drill 0.46)
  Top 0.457: v107.79,161.45 108.17,161.83 111.22,161.83 111.98,161.07 111.98,159.93 119.98,151.92 119.98,135.54 114.65,130.21 114.65,105.06 116.56,103.16 116.56,90.96 109.32,83.72 109.32,82.96 FOD6.2 | IC3.10 v79.98,147.35
  Bottom 0.457: v107.79,161.45 102.08,161.45 87.98,147.35 v79.98,147.35
N$26
  Top 0.457: FOD1.3 110.84,158.02 110.84,157.26 117.7,150.4 117.7,144.69 R17.2
N$27
  Top 0.457: FOD4.3 112.36,30.77 112.36,30 119.22,23.15 119.22,21.62 R18.2
N$28
  Top 0.457: FOD6.3 109.32,79.92 109.32,79.15 115.41,73.06 115.41,71.53 R20.2
N$30
  Top 0.457: T4.2 97.5,68.48 97.5,79.15 100.93,82.58 100.93,109.25 103.22,111.54 103.22,125.25 101.31,127.16 R12.2
N$31
  Top 0.457: T4.1 95.22,65.82 95.22,69.25 96.36,70.39 96.36,78.01 95.22,79.15 95.22,108.49 99.41,112.68 99.41,136.68 100.55,137.83 R13.2 100.55,138.21 97.89,140.88 97.89,152.31 100.55,154.97 100.55,157.64 R6.2
N$32  (via drill 0.46)
  Top 0.457: v39.59,130.59 39.59,147.73 37.69,149.64 D5.C
  Bottom 0.457: IC1.3 63.22,108.49 57.12,108.49 54.83,110.78 42.26,110.78 41.88,111.16 30.83,111.16 27.78,114.2 27.78,124.11 31.21,127.54 33.88,127.54 34.64,128.3 37.31,128.3 v39.59,130.59
N$33
  Top 0.457: IC7.12 36.16,123.73 39.97,127.54 54.07,127.54 61.69,119.92 70.45,119.92 72.36,121.83 IC5.5
N$34  (via drill 2.54)
  other vias: 147.17,109.52
N$35  (via drill 0.46)
  Top 0.457: v29.31,142.02 29.31,122.59 30.45,121.44 31.21,121.44 33.12,123.35 IC7.13 36.16,120.68 43.78,120.68 48.36,116.11 v48.36,108.87 | v48.36,104.68 v48.36,95.54
  Bottom 0.457: v29.31,142.02 30.45,143.16 36.16,143.16 38.07,141.26 IC4.11 | v48.36,95.54 46.07,93.25 46.07,84.49 IC9.8 | v48.36,108.87 v48.36,104.68
N$36  (via drill 0.46)
  Top 0.457: v44.93,111.92 44.93,110.78 48.74,106.97 v51.4,106.97 | v57.12,101.25 57.12,93.25 v61.31,89.06
  Bottom 0.457: v44.93,111.92 IC7.5 | v57.12,101.25 v51.4,106.97 | v61.31,89.06 62.45,89.06 63.6,87.92 63.6,85.25 72.74,76.11 72.74,73.44 IC12.12
N$37
  Bottom 0.457: IC7.6 43.78,116.11 45.69,118.02 52.93,118.02 54.07,116.87 75.03,116.87 78.84,120.68 78.84,127.16 79.98,128.3 79.98,129.44 IC5.9
N$38  (via drill 0.46)
  Top 0.457: v84.17,143.92 v84.17,158.78 | v80.74,134.02 77.69,130.97 77.69,129.83 IC5.10
  Bottom 0.457: v84.17,158.78 75.03,167.93 IC14.9 | v84.17,143.92 84.17,142.4 80.74,138.97 v80.74,134.02
N$39  (via drill 0.46)
  Top 0.457: v33.12,93.25 40.74,85.63 40.74,84.49 IC9.10 | v27.78,111.54 27.78,143.92 v38.83,154.97 | IC14.11 72.36,165.64 72.36,160.69 IC14.5
  Bottom 0.457: v33.12,93.25 31.97,93.25 28.54,96.68 28.54,110.78 v27.78,111.54 | v38.83,154.97 39.97,154.97 44.93,159.93 44.93,160.69 49.12,164.88 56.74,164.88 66.64,174.78 69.69,174.78 70.45,174.02 70.45,168.69 70.07,168.31 IC14.11
N$40
  Bottom 0.457: IC14.8 77.69,167.93 79.22,167.93 83.41,163.74 91.03,163.74 92.17,162.59 92.17,161.83 82.27,151.92 79.6,151.92 78.84,151.16 78.84,138.59 73.12,132.87 70.45,132.87 67.41,129.83 IC5.14
N$41
  Top 0.457: IC6.5 40.9,54.48 37.38,50.96 PTR_L_R.1
N$42  (via drill 2.54)
  Bottom 12.7: v146.97,24.14 146.97,12.24 146.93,12.19
N$43
  Top 0.559: R35.2 257.91,182.23 IC8.2
N$45
  Top 0.457: POT_OC(+VE)_1.1 90.27,27.72 90.27,14 LM317_I(+VE)_1.1
  Bottom 0.457: R51.2 76.17,29.24 88.74,29.24 89.89,28.1 POT_OC(+VE)_1.1
N$46
  Top 2.54: C7.2 174.28,158.34 D16.A 180.04,155.06 R1.1
N$47  (via drill 2.54)
  Bottom 12.7: v146.9,63.01 146.9,41.93
N$48
  Top 0.457: R40.1 43.44,67.22 IC6.9
  Bottom 0.457: R21.1 43.44,65.25 IC6.9
N$49
  Bottom 0.457: IC6.8 49.73,67.88 R40.2 56.6,67.88 60.45,64.03 R41.1
N$51
  Bottom 0.559: D8.A 184.34,88.31 D7.A
N$52
  Top 0.559: D10.A 173.41,47.01 D9.A
N$53
  Bottom 0.559: D12.A 173.77,179.06 D11.A
N$54
  Top 0.559: D14.A 181.47,132.4 D13.A
N$55  (via drill 0.46)
  Top 0.457: v36.93,72.68 40.74,76.49 IC9.5 | v27.4,98.58 28.54,98.58 31.97,102.01 39.59,102.01 43.4,105.82 IC11.9
  Bottom 0.457: v36.93,72.68 32.35,72.68 27.4,77.63 v27.4,98.58
N$56
  Bottom 0.457: IC6.13 37.22,68.07 R42.1 39.54,68.07 42.18,65.43 42.18,62.4 43.87,60.71 49.85,60.71 R41.2
N$57
  Bottom 0.457: IC11.1 30.83,98.58 32.73,100.49 53.31,100.49 54.45,99.35 59.79,99.35 64.74,104.3 IC1.2
N$58  (via drill 0.46)
  Top 0.457: v20.16,97.06 v25.11,92.11
  Bottom 0.457: v25.11,92.11 25.11,73.44 24.73,73.06 24.73,67.72 31.85,60.61 41.75,60.61 45.69,56.67 IC6.7 | v20.16,97.06 20.16,144.69 27.78,152.31 38.83,152.31 41.12,150.02 D6.A
N$59
  Top 0.457: IC1.4 69.69,104.68 67.03,107.35 67.03,107.73 66.26,108.49 56.74,108.49 54.07,105.82 46.07,105.82 IC11.8
N$60  (via drill 0.46)
  Top 0.457: v63.6,125.64 84.55,125.64 87.98,122.21 89.12,122.21 92.17,119.16 92.17,113.82 88.36,110.01 78.07,110.01 72.74,104.68 IC1.5
  Bottom 0.457: v63.6,125.64 52.17,137.06 52.17,149.26 51.78,149.64 D6.C
N$61
  Top 0.457: R22.2 71.22,38.01 68.17,34.96 68.17,28.1 POT_OC(+VE)_2.1 68.17,27.72 68.17,14 LM317_I(+VE)_2.1
N$63
  Top 0.457: IC2.1 29.31,37.62 29.31,44.86 31.21,46.77 38.83,46.77 47.98,55.91 47.98,64.67 43.78,68.87 43.78,76.49 IC9.6
N$64  (via drill 0.46)
  Top 0.457: v96.36,145.83 96.36,155.73 102.46,161.83 102.46,162.97 99.79,165.64 99.79,172.88 100.93,174.02 R8.1
  Bottom 0.457: IC1.6 70.07,109.25 60.55,109.25 59.79,110.01 59.79,111.92 63.98,116.11 76.93,116.11 83.03,122.21 83.03,138.21 90.65,145.83 v96.36,145.83
N$65
  Top 0.457: LED_VOLTAGE/CURRENT_FAULT1.K 71.98,173.64 90.27,173.64 90.65,174.02 R8.2
N$67  (via drill 0.46)
  Top 0.457: v91.41,66.96 91.41,111.92 92.93,113.44 92.93,149.26 89.5,152.69 89.5,154.59 95.22,160.31 95.22,171.74 87.6,179.36 73.88,179.36 VOLTAGE/CURRENT_FAULT_CLR1.1 | IC2.3 36.16,36.1 36.93,35.34 36.93,34.96 37.69,34.2 52.29,34.2 58.54,40.44 63.83,40.44 v65.63,42.25
  Bottom 0.457: v91.41,66.96 91.41,63.56 73.68,45.83 73.68,43.7 72.28,42.3 65.68,42.3 v65.63,42.25
N$90  (via drill 0.46)
  Top 0.457: v29.31,92.11 22.83,98.58 22.83,128.3 24.73,130.21 24.73,153.45 34.64,163.35 | 34.64,163.35 39.97,163.35 R29.1 | 34.64,163.35 33.12,164.88 33.12,169.83 C5.2
  Bottom 0.457: v29.31,92.11 42.26,92.11 47.98,97.82 63.98,97.82 64.74,97.06 64.74,94.77 IC10.15
N$91  (via drill 0.46)
  Top 0.457: v80.36,89.82 77.69,87.15 IC10.7
  Bottom 0.457: C10.2 33.12,157.26 33.12,161.83 39.97,168.69 39.97,169.83 R30.1 40.35,170.21 45.31,170.21 51.4,176.31 81.88,176.31 85.69,172.5 103.22,172.5 113.51,162.21 113.51,156.5 111.22,154.21 109.7,154.21 98.27,142.78 98.27,138.21 89.5,129.44 89.5,115.73 86.08,112.3 86.08,95.54 v80.36,89.82
N$92  (via drill 0.46)
  Top 0.457: v31.59,74.96 28.54,74.96 v15.21,88.3
  Bottom 0.457: v31.59,74.96 32.35,74.2 47.21,74.2 47.98,74.96 63.6,74.96 65.12,73.44 IC12.15 | v15.21,88.3 14.45,88.3 10.26,92.49 10.26,145.45 29.69,164.88 31.59,164.88 | 31.59,164.88 32.73,163.74 C11.2 | 31.59,164.88 39.97,173.26 39.97,176.69 R31.1
N$95  (via drill 0.46)
  Top 0.457: v26.64,136.68 26.64,130.97 27.02,130.59 27.02,112.3 26.26,111.54 26.26,98.2 30.07,94.39 v53.31,94.39
  Bottom 0.457: v26.64,136.68 28.93,136.68 33.12,140.88 IC4.13 | v53.31,94.39 59.79,94.39 63.22,90.96 65.88,90.96 69.69,87.15 IC10.4
N$97  (via drill 0.46)
  Top 0.457: v38.45,147.35 36.16,145.07 36.16,141.26 IC4.12
  Bottom 0.457: v38.45,147.35 46.07,147.35 51.4,142.02 51.4,136.3 63.98,123.73 65.5,123.73 IC5.3
N$98
  Bottom 0.457: IC7.1 30.83,116.11 34.64,119.92 62.83,119.92 64.74,121.83 IC5.2
N$100  (via drill 0.46)
  Top 0.457: v72.74,119.16 79.22,119.16 79.98,118.4 90.65,118.4 R37.1
  Bottom 0.457: v72.74,119.16 70.07,121.83 IC5.4
N$101
  Top 0.457: T1.2 96.74,108.11 96.74,108.87 100.93,113.06 100.93,118.4 R37.2
N$102
  Top 0.457: T1.1 94.08,105.44 94.08,108.49 95.22,109.63 95.22,148.88 R36.2 91.03,153.45 99.79,162.21 100.55,162.21 R38.2
N$103  (via drill 0.46)
  Top 0.457: v64.74,145.45 63.6,144.3 63.6,128.3 65.5,126.4 84.93,126.4 88.36,122.97 90.65,122.97 R39.1
  Bottom 0.457: v64.74,145.45 64.74,149.64 IC3.15
N$104
  Top 0.457: T2.2 96.74,94.01 96.74,106.2 102.46,111.92 102.46,121.44 101.31,122.59 R39.2
N$105
  Top 0.457: R53.2 101.31,166.02 101.31,165.26 103.22,163.35 103.22,146.21 100.93,143.92 R52.2
  Bottom 0.457: T2.1 94.08,91.34 94.08,94.39 99.03,99.35 99.03,142.02 100.55,143.54 R52.2
N$107  (via drill 0.46)
  Top 0.457: v58.26,106.2 62.83,106.2 63.6,105.44 63.6,103.16 v66.64,100.11
  Bottom 0.457: v58.26,106.2 54.45,110.01 41.88,110.01 41.5,110.39 30.45,110.39 27.02,113.82 27.02,124.49 31.59,129.06 36.55,129.06 40.74,133.25 IC4.5 | v66.64,100.11 72.36,94.39 IC10.12
N$108  (via drill 0.46)
  Top 0.457: v46.45,145.45 46.45,146.97 53.31,153.83 71.22,153.83 75.03,150.02 IC3.11
  Bottom 0.457: v46.45,145.45 47.21,144.69 47.21,132.11 46.45,131.35 45.69,131.35 43.78,133.25 IC4.6
N$109
  Top 0.457: IC4.9 43.78,141.26 51.02,148.5 58.64,148.5 63.22,153.07 70.83,153.07 72.36,151.54 72.36,150.02 IC3.12
N$110
  Top 0.457: IC4.8 46.07,141.26 59.02,141.26 67.41,149.64 IC3.14
N$119  (via drill 0.46)
  Top 0.457: v46.83,161.07 33.12,174.78 33.12,176.69 C15.2 | IC12.7 79.98,63.53 81.12,63.53 81.88,64.29 v81.88,84.49 | v84.17,114.97 v87.22,111.92 | v84.17,127.54 71.98,127.54 71.22,128.3 71.22,130.59 v67.03,134.78
  Bottom 0.457: v46.83,161.07 46.83,160.69 50.26,157.26 R32.1 50.64,157.26 51.78,158.4 53.31,158.4 54.07,157.64 54.07,139.73 58.64,135.16 62.83,135.16 63.22,134.78 v67.03,134.78 | v81.88,84.49 81.88,90.2 87.22,95.54 v87.22,111.92 | v84.17,127.54 v84.17,114.97
N$202
  Top 0.457: R86.1 35.48,20.86 38.04,20.86 39.36,22.18 39.36,24.21 41.5,26.35 S6.2
N$203
  Top 0.457: R86.2 43.02,17.81 43.02,12.48 LED_MASTER.A
N$205
  Top 0.457: R87.1 45.73,22.27 S5.5
  Bottom 0.457: 46.07,18.19 R87.1
N$208
  Top 0.457: LED_BYPASS.A 55.98,12.86 55.98,17.81 R87.2
PTR  (via drill 0.46)
  Top 0.457: v45.31,130.21 47.21,132.11 47.21,134.78 IC4.10 41.12,141.26 41.12,142.78 51.78,153.45 51.78,157.64 56.74,162.59 67.79,162.59 IC14.4 | v25.9,69.65 19.02,62.77 19.02,28.89 37.56,10.34 47.06,10.34 52.09,15.37 52.09,25.2 53.23,26.35 S5.2 | v27.4,109.63 33.5,115.73 IC7.2
  Bottom 0.457: IC14.4 70.07,160.69 70.07,164.5 72.36,166.78 72.36,167.93 IC14.10 | v45.31,130.21 42.64,127.54 35.02,127.54 34.26,126.78 31.59,126.78 28.54,123.73 28.54,114.59 30.07,113.06 38.07,113.06 39.59,114.59 39.59,117.25 38.83,118.02 35.4,118.02 33.5,116.11 IC7.2 | v25.9,69.65 25.9,91.37 26.26,91.73 26.26,95.16 25.11,96.3 25.11,107.35 v27.4,109.63
PTR_1  (via drill 0.46)
  Top 0.457: v83.03,111.54 76.55,118.02 62.07,118.02 56.74,123.35 46.07,123.35 IC7.8 | v83.03,94.39 83.03,53.63 v83.41,53.24 | S5.3 59.2,28.12 59.2,32.21 63.24,36.25 64.92,36.25 67.51,38.84 v67.51,40.95
  Bottom 0.457: v83.03,94.39 v83.03,111.54 | v83.41,53.24 83.51,53.14 83.51,51.24 73.22,40.95 v67.51,40.95
PTR_LOWER_REF  (via drill 0.46)
  Top 0.457: R21.2 50.9,67.95 50.9,64.09 52.9,62.08 52.9,53.3 v51.23,51.62 47.65,51.62 PTR_L_UNSCALED.1
  Bottom 0.457: 61.31,35.87 61.31,18.19 63.65,15.86 | C22.2 61.31,35.87 | 61.31,35.87 61.31,38.01 R22.1 57.42,41.89 57.42,45.42 v51.23,51.62 | C30.+ 63.65,19.57 63.65,15.86 | LM317_I(+VE)_2.2 65.36,14.14 63.65,15.86
PTR_S_L_R
  Top 0.457: PTR_S_L_R.1 26.69,68.07 R42.2 | R42.2 30.74,65.39 IC6.14 | PTR_L.1 12.64,75.04 12.64,73.97 13.86,72.75 16.84,72.75 18.43,71.15 26.77,71.15 28.06,69.86 R42.2
PTR_UPPER_REF  (via drill 0.46)
  Top 0.457: v20.92,68.87 17.5,68.87 15.06,71.3 PTR_U.1 | 71.6,44.48 R51.1 71.6,44.1 72.74,42.96 72.74,38.39 87.6,23.53 87.6,14 | 87.6,14 LM317_I(+VE)_1.2 | v62.12,55.86 64.18,55.86 65.92,54.12 C27.2 | 87.6,14 86.47,15.13 86.47,15.19 81.23,20.43 C31.+
  Bottom 0.457: v20.92,68.87 IC6.2 33.28,55.29 34.11,54.46 60.73,54.46 v62.12,55.86 | C27.2 67.72,52.04 68.4,51.37 68.4,47.17 R51.1
Q_BAR  (via drill 0.46)
  Top 0.457: v85.31,65.06 85.31,106.58 84.55,107.35 80.36,107.35 77.69,104.68 IC1.7
  Bottom 0.457: v85.31,65.06 73.88,53.63 45.69,53.63 36.16,44.1 IC2.14 | IC1.9 79.98,111.92 79.98,107.73 77.69,105.44 77.69,104.68 IC1.7
S1_B
  Bottom 0.457: IC3.3 67.41,142.4 67.41,144.69 71.22,148.5 71.22,151.16 73.12,153.07 81.5,153.07 90.65,162.21 R38.1
S1_G
  Top 0.559: FOD1.6 FOD1.7 119.15,161.53 121.88,161.53 123.81,163.46 S11.1 | R7.2 169.92,174.69 R33.2 165.65,165.83 163.32,163.49 S1.1
  Bottom 0.559: S11.1 161.07,163.46 S1.1
S1_GND
  Top 2.54: D16.C 181.26,167.91 187.37,167.91 | D15.A 191.81,125.1 191.81,125.99
  Top 3.81: Q1.3 187.37,167.91 | 218.43,121.04 213.44,126.03 Q2.2 207.66,125.99 198.39,125.99
  Top 6.35: 187.37,167.91 187.37,130.44 191.81,125.99 198.39,125.99 | H1.B5,5 283.08,121.04 218.43,121.04
  Bottom 0.457: C17.1 125.25,160.55 C12.2 120.63,171.16 PS1.6 | S1.2 161.54,166.47 R26.2
  Bottom 0.559: C12.2 130.26,166.54 S11.2 161.07,166 S1.2 165.36,166.03 168.01,163.38 176.73,163.38 D16.C 176.77,171.9 D11.C
S2_B  (via drill 0.46)
  Top 0.457: v61.31,164.5 63.6,166.78 v63.6,173.26
  Bottom 0.457: v61.31,164.5 58.26,161.45 58.26,136.68 59.02,135.92 69.31,135.92 73.12,139.73 73.12,140.49 72.74,140.88 72.74,142.02 IC3.5 | v63.6,173.26 65.88,175.55 81.5,175.55 90.65,166.4 R53.1
S2_G
  Top 0.559: FOD3.6 FOD3.7 132.18,113.91 S22.1 | S2.1 164.54,117.28 166.68,119.42 166.68,124.35 R14.2 164.42,126.61 R34.2
  Bottom 0.559: S22.1 161.88,117.22 S2.1
S2_S4_GND
  Top 2.54: C6.2 170.85,121.41 D13.C 170.59,131.95 167.86,134.68 R27.2
  Top 3.81: Q4.3 216.87,83.69 221.81,88.63
  Top 6.35: 221.81,88.63 221.93,88.74 R28_10KΩ.1 238.37,96.04 261.56,96.04 261.75,96.23 C2_470µF.1
  Bottom 0.457: PS3.6 122.72,120.16 C19.2 122.51,120.39 C13.2
  Bottom 0.559: 122.72,120.16 123.07,119.81 C16.2 123.07,82.44 C20.2 132.18,73.34 S44.2 161.87,72.99 S4.2 158.59,76.27 158.59,87.67 159.96,89.05 173.74,89.05 D7.C | C19.2 124.96,117.71 130.69,117.71 132.74,119.75 S22.2 161.88,119.75 S2.2 172.44,119.82 C6.2 161.34,104.73 R24.2 | C2.B5,5 279.4,160.78 IC8.1
  Bottom 2.54: 218.79,84.64 218.79,65.11 214.21,60.52 187.79,60.52 | Q2.3 195.97,131.49 186.51,140.95 R27.2 164.8,144.01 R1.2 | R3.2 187.79,60.52 | 187.79,60.52 187.79,43.77 185.78,41.76 180.07,41.76 C8.2
  Bottom 3.81: 218.79,84.64 217.84,83.69 Q4.3 | Q2.3 213.54,131.49 217.16,135.11
  Bottom 6.35: R28_10KΩ.1 231.07,68.93 249.83,50.17 261.88,50.17 | C2_470µF.1 261.75,139.67 C1_470µF.1 294.52,143.12 C2.B5,5 | 218.79,84.64 220.47,86.32 220.47,126.35 220.49,126.37 220.49,135.21 217.27,135.21 217.16,135.11 | H3.B5,5 278.04,48.74 C3_470µF.1 261.88,50.17 | 261.88,50.17 C4_470µF.1
S3_B
  Top 0.457: IC3.7 77.69,142.4 77.69,143.54 81.5,147.35 81.5,151.16 78.84,153.83 78.84,158.02 90.65,169.83 R11.1
S3_G
  Top 0.559: FOD4.7 FOD4.6 127.57,30.83 S33.1 | S3.1 166.48,31.5 168.79,33.81 R23.1 168.66,38.2 R15.1
  Bottom 0.559: S33.1 163.71,31.53 S3.1
S3_GND
  Top 0.457: C14.2 C18.2
  Top 0.559: D18.A 183.41,71.56 183.41,65.21 179.93,61.73 179.93,54.31 D9.C
  Top 2.54: D18.A 199.51,76.3 201.44,78.23 Q4.2
  Top 3.81: Q4.2 221.39,78.23 223.26,76.36 | 220.77,38.59 218.6,36.42 Q3.3
  Top 6.35: H2.B5,5 295.12,76.36 223.26,76.36 223.26,41.08 220.77,38.59
  Bottom 0.559: PS2.6 121.29,42.67 C14.2 120.68,41.65 S33.2 163.71,34.07 S3.2 | S3.2 175.23,34.04 D17.C | R25.2 161.39,37.42 163.74,35.07 S3.2
  Bottom 2.54: D17.C 190.07,36.42 Q3.3
S4_B
  Bottom 0.457: IC3.9 80.36,150.02 81.88,150.02 89.5,157.64 90.65,157.64 R6.1
S4_G
  Top 0.559: FOD6.7 FOD6.6 119.81,80.16 129.53,70.43 132.15,70.43 S44.1 | R16.1 165.84,77.26 165.86,77.25 | 165.86,77.25 R28.1 | S4.1 164.24,70.42 165.86,72.03 165.86,77.25
  Bottom 0.559: S44.1 161.87,70.45 S4.1
S222
  Bottom 0.559: Q2.1 183.85,120.57 174.31,130.1 174.31,134.4 172.22,136.49 D14.C 171.18,136.62 R14.1 164.42,136.77 R34.1 157.7,139.71 R27.1
V_IN_+15V
  Top 0.457: PS2.1 108.55,54.77 108.55,73.82 103.6,78.77 103.6,107.35 105.12,108.87 105.12,126.4 109.7,130.97 PS3.1 110.08,131.35 110.08,136.3 111.98,138.21 111.98,148.11 105.89,154.21 105.89,175.93 PS1.1 108.17,178.21 108.17,195.74 C23.2 107.79,196.12 107.79,208.31 107.41,208.69 X3.1 107.03,209.07 104.36,211.74 79.22,211.74 60.17,192.69 PS5.1
  Bottom 0.457: PS4.1 35.4,192.69 37.69,194.98 57.5,194.98 59.79,192.69 PS5.1 | C23.2 108.17,196.12 116.24,204.19 233.64,204.19 PS6.1
V_IN_GND
  Top 0.457: PS2.2 110.84,54.77 110.84,72.68 106.27,77.25 106.27,107.73 105.89,108.11 105.89,124.49 112.36,130.97 PS3.2 112.75,131.35 112.75,148.5 106.65,154.59 106.65,174.02 110.46,177.83 PS1.2 110.46,178.21 110.46,195.74 C23.1 110.84,196.12 110.84,207.55 111.98,208.69 X3.2
  Bottom 0.457: PS4.2 38.07,192.69 41.12,192.69 42.64,194.22 55.98,194.22 59.02,191.17 60.93,191.17 62.07,192.31 PS5.2 62.45,192.69 66.26,192.69 85.31,211.74 109.32,211.74 111.98,209.07 X3.2 119.86,216.47 231.67,216.47 PS6.2
V_SM
  Top 0.559: R28_10KΩ.2 231.07,170.63 R35.1
  Top 2.54: C7.1 174.33,173.37 Q1.2 | C2_470µF.2 248.99,102.8 189.78,102.8 187.55,100.56 187.55,83.22 185.38,81.05 C9.1 170.01,82.57 170.01,90.98 R2.1
  Top 3.81: Q3.2 210.29,30.96 213.61,27.64 | Q1.2 199.23,173.44 204.82,173.44
  Top 6.35: C3_470µF.2 C4_470µF.2 217.28,23.97 213.61,27.64 | C1.B5,5 275.44,170.28 C1_470µF.2 232.68,153.13 R28_10KΩ.2 212.38,173.44 204.82,173.44
  Bottom 2.54: R4.1 196.2,30.96 Q3.2
  Bottom 6.35: C3_470µF.2 251.87,105.43 C2_470µF.2 248.91,108.39 248.91,152.91 249.13,153.13 C1_470µF.2
V_SM_VS  (via drill 0.46)
  Top 0.457: IC6.3 36.16,56.67 38.07,58.58 41.5,58.58 43.4,56.67 IC6.6 | v23.97,73.82 12.54,85.25 12.54,92.11 V_SM.1 | v18.21,137 18.17,137.04 v18.17,162.16 | C28.+ 240.02,216.92 C29.1
  Bottom 0.457: v23.97,73.82 23.97,67.34 32.73,58.58 33.88,58.58 35.78,56.67 IC6.3 | v18.17,162.16 18.17,180.74 55.09,217.66 233.57,217.66 234.31,216.92 C28.+ | v18.21,137 18.21,98.15 12.54,92.49 V_SM.1 | C29.1 245.08,214.48 246.63,212.94 249.91,212.94 250.96,213.99 R9.2 253.64,212.88 269.15,212.88 IC8.3

## Text on the board
tNames: GND | +5V | GND | +15V | GND | +15V | +9V | GND | -15V | DC Power Supply | Power Swithes | Voltage Sensor Circuit | Blanking and Protection Circuit | Q1 | Capacitor Terminal | Submodule Capacitors and Bleeder Resistor | C1[+] | + | _ | G1_B | G2_B | C2[-] | Q2 | G3_B | G3_B | G4_B | Block | G2_C | G1_C | _ | Signal From DSP | + | H1[FB1] | V_SM | Signal to DSP | Q4 | _ | + | H2[FB2] | H3[HB] | Q3 | Power Connections | _ | + | Gate Driver Circuit | Smart Energy Conversion Laboratory